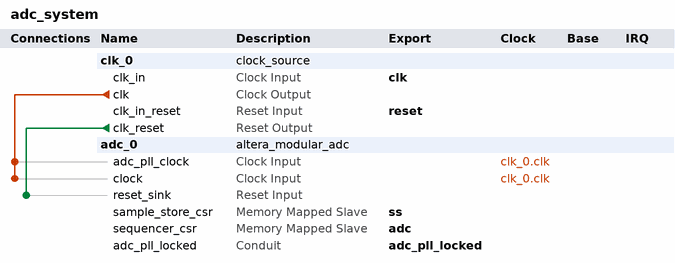
[diagram p0: system contents]
# Platform Designer (Qsys) system adc_system, MAX 10 10M50DAF484C7G
# Parameters at their usual value, and those the tool derives, are not listed.
package require -exact qsys 17.1
create_system adc_system
set_project_property DEVICE_FAMILY {MAX 10}
set_project_property DEVICE 10M50DAF484C7G

add_instance clk_0 clock_source 17.1
set_instance_parameter_value clk_0 clockFrequency 50000000

add_instance adc_0 altera_modular_adc 17.1
set_instance_parameter_value adc_0 CLOCK_FREQ 50000000
set_instance_parameter_value adc_0 CORE_VAR 0
set_instance_parameter_value adc_0 DEVICE_PART 10M50DAF484C7G
set_instance_parameter_value adc_0 clkdiv 2
set_instance_parameter_value adc_0 int_vref_vr 3.0
set_instance_parameter_value adc_0 refsel 0
set_instance_parameter_value adc_0 sample_rate 0
set_instance_parameter_value adc_0 seq_order_length 1
set_instance_parameter_value adc_0 seq_order_slot_1 1
set_instance_parameter_value adc_0 seq_order_slot_2 30
set_instance_parameter_value adc_0 seq_order_slot_3 30
set_instance_parameter_value adc_0 seq_order_slot_4 30
set_instance_parameter_value adc_0 seq_order_slot_5 30
set_instance_parameter_value adc_0 seq_order_slot_6 30
set_instance_parameter_value adc_0 seq_order_slot_7 30
set_instance_parameter_value adc_0 use_ch0 false
set_instance_parameter_value adc_0 use_ch2 false
set_instance_parameter_value adc_0 use_ch3 false
set_instance_parameter_value adc_0 use_ch4 false
set_instance_parameter_value adc_0 use_ch5 false
set_instance_parameter_value adc_0 use_ch6 false
set_instance_parameter_value adc_0 use_ch7 false
set_instance_parameter_value adc_0 use_ch8 false
set_instance_parameter_value adc_0 use_tsd false

# connections
add_connection clk_0.clk adc_0.adc_pll_clock clock
add_connection clk_0.clk adc_0.clock clock
add_connection clk_0.clk_reset adc_0.reset_sink reset

# exported interfaces
add_interface adc avalon slave
set_interface_property adc EXPORT_OF adc_0.sequencer_csr
add_interface adc_pll_locked conduit end
set_interface_property adc_pll_locked EXPORT_OF adc_0.adc_pll_locked
add_interface clk clock sink
set_interface_property clk EXPORT_OF clk_0.clk_in
add_interface reset reset sink
set_interface_property reset EXPORT_OF clk_0.clk_in_reset
add_interface ss avalon slave
set_interface_property ss EXPORT_OF adc_0.sample_store_csr

set_interconnect_requirement {$system} qsys_mm.clockCrossingAdapter HANDSHAKE
set_interconnect_requirement {$system} qsys_mm.enableEccProtection FALSE
set_interconnect_requirement {$system} qsys_mm.insertDefaultSlave FALSE
set_interconnect_requirement {$system} qsys_mm.maxAdditionalLatency 1

save_system adc_system.qsys
